# EAGLE schematic radar (EAGLE 6.6.0)
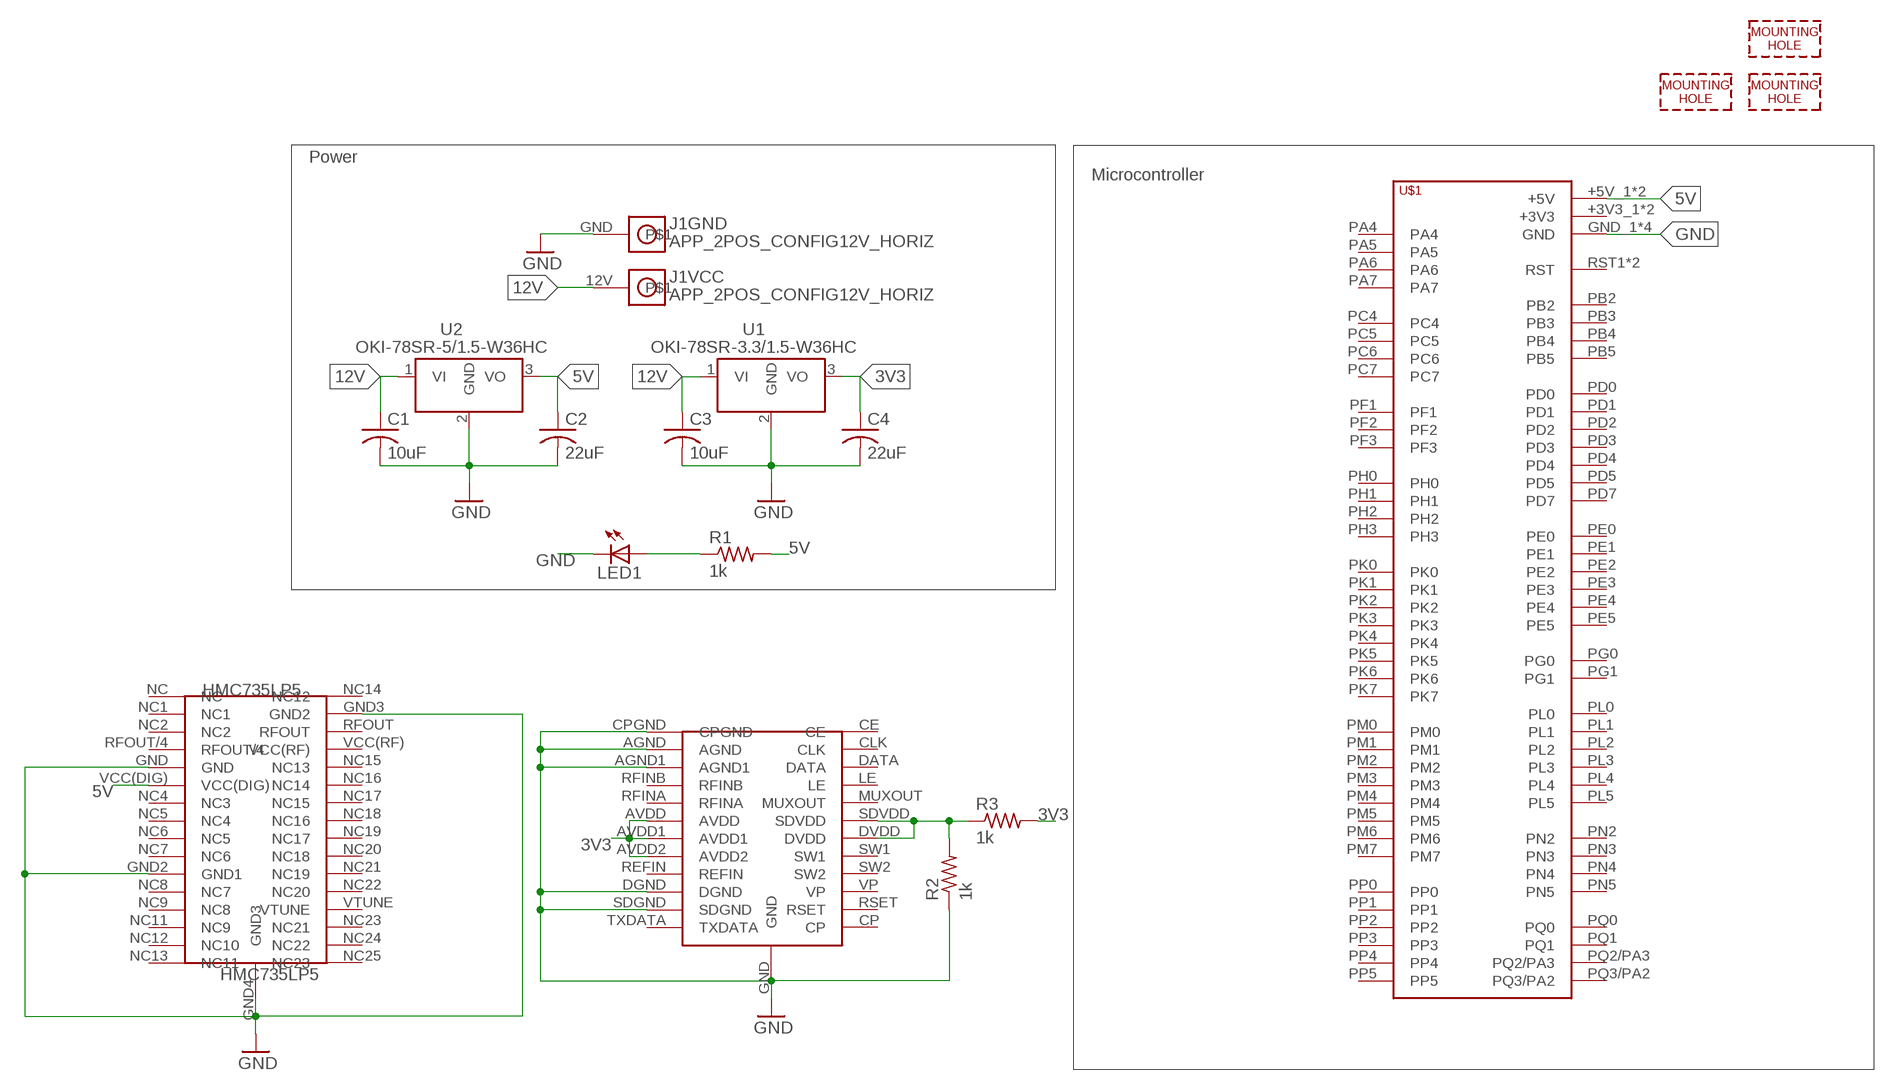
[diagram p0: schematic, sheet 1]

## Parts
C1  10uF  C-USC0603  [C0603]
C2  22uF  C-USC0603  [C0603]
C3  10uF  C-USC0603  [C0603]
C4  22uF  C-USC0603  [C0603]
H1  MOUNTING_HOLE#6  [#6_SCREW]
H2  MOUNTING_HOLE#6  [#6_SCREW]
H3  MOUNTING_HOLE#6  [#6_SCREW]
J1  APP_2POS_CONFIG12V_HORIZ  [APP45_12V_HORIZ_CONFIG]
LED1  LEDCHIP-LED0805  [CHIP-LED0805]
R1  1k  R-US_M0805  [M0805]
R2  1k  R-US_M0805  [M0805]
R3  1k  R-US_M0805  [M0805]
U1  OKI-78SR-3.3/1.5-W36HC  [OKI-78SR_HORIZ]
U2  OKI-78SR-5/1.5-W36HC  [OKI-78SR_HORIZ]
U$1  TIVA-1294  [TIVA-C-CONNECTED]
U$2  HMC735LP5  [HMC735LP5]
U$3  ADF4169  [ADF4169]

## Nets
3V3: C4.1 R3.2 U1.3(VO) U$3.AVDD U$3.AVDD1 U$3.AVDD2
5V: C2.1 R1.2 U2.3(VO) U$1.+5V_1(+5V) U$1.+5V_2(+5V) U$2.VCC(DIG)
12V: C1.1 C3.1 J1.12V U1.1(VI) U2.1(VI)
GND: C1.2 C2.2 C3.2 C4.2 J1.GND LED1.C R2.1 U1.2(GND) U2.2(GND) U$1.GND_1(GND) U$1.GND_2(GND) U$1.GND_3(GND) U$1.GND_4(GND) U$2.GND U$2.GND2(GND1) U$2.GND3(GND2) U$2.GND4(GND3) U$3.AGND U$3.AGND1 U$3.CPGND U$3.DGND U$3.GND U$3.SDGND
N$1: LED1.A R1.1
N$2: R2.2 R3.1 U$3.DVDD U$3.SDVDD
Unconnected: U$1.+3V3_1(+3V3) U$1.+3V3_2(+3V3) U$1.PA4 U$1.PA5 U$1.PA6 U$1.PA7 U$1.PB2 U$1.PB3 U$1.PB4 U$1.PB5 U$1.PC4 U$1.PC5 U$1.PC6 U$1.PC7 U$1.PD0 U$1.PD1 U$1.PD2 U$1.PD3 U$1.PD4 U$1.PD5 U$1.PD7 U$1.PE0 U$1.PE1 U$1.PE2 U$1.PE3 U$1.PE4 U$1.PE5 U$1.PF1 U$1.PF2 U$1.PF3 U$1.PG0 U$1.PG1 U$1.PH0 U$1.PH1 U$1.PH2 U$1.PH3 U$1.PK0 U$1.PK1 U$1.PK2 U$1.PK3 U$1.PK4 U$1.PK5 U$1.PK6 U$1.PK7 U$1.PL0 U$1.PL1 U$1.PL2 U$1.PL3 U$1.PL4 U$1.PL5 U$1.PM0 U$1.PM1 U$1.PM2 U$1.PM3 U$1.PM4 U$1.PM5 U$1.PM6 U$1.PM7 U$1.PN2 U$1.PN3 U$1.PN4 U$1.PN5 U$1.PP0 U$1.PP1 U$1.PP2 U$1.PP3 U$1.PP4 U$1.PP5 U$1.PQ0 U$1.PQ1 U$1.PQ2/PA3 U$1.PQ3/PA2 U$1.RST1(RST) U$1.RST_2(RST) U$2.NC U$2.NC1 U$2.NC2 U$2.NC4(NC3) U$2.NC5(NC4) U$2.NC6(NC5) U$2.NC7(NC6) U$2.NC8(NC7) U$2.NC9(NC8) U$2.NC11(NC9) U$2.NC12(NC10) U$2.NC13(NC11) U$2.NC14(NC12) U$2.NC15(NC13) U$2.NC16(NC14) U$2.NC17(NC15) U$2.NC18(NC16) U$2.NC19(NC17) U$2.NC20(NC18) U$2.NC21(NC19) U$2.NC22(NC20) U$2.NC23(NC21) U$2.NC24(NC22) U$2.NC25(NC23) U$2.RFOUT U$2.RFOUT/4 U$2.VCC(RF) U$2.VTUNE U$3.CE U$3.CLK U$3.CP U$3.DATA U$3.LE U$3.MUXOUT U$3.REFIN U$3.RFINA U$3.RFINB U$3.RSET U$3.SW1 U$3.SW2 U$3.TXDATA U$3.VP

## Notes on the sheet
- Power
- Microcontroller

## Library data of the parts
C1-C4 = rcl:C-US: CAPACITOR, American symbol
H1-H3 = MRDT-Hardware:MOUNTING_HOLE: Mounting hole for M6 bolt. Standard use mounting hole for: Tiva C Connected - M6 Anderson Powerpole Mounting Wing - M8 Most frame-mounted PCB's - M8
J1 = MRDT-Connectors:APP_2POS_CONFIG; COLOR1: YELLOW; COLOR2: BLACK
LED1 = led:LED: LED OSRAM: - CHIPLED LG R971, LG N971, LY N971, LG Q971, LY Q971, LO R971, LY R971 LH N974, LH R974 LS Q976, LO Q976, LY Q976 LO Q996 - Hyper CHIPLED LW Q18S LB Q993, LB Q99A, LB R99A - SideLED LS A670, LO A670, LY A670, LG A670, LP A670 LB A673, LV A673, LT A673, LW A673 LH A674 LY A675 LS A676, LA A676, LO A676, LY A676, LW A676 LS A679, LY A679, LG A679 - Hyper Micro SIDELED® LS Y876, LA Y876, LO Y876, LY Y876 LT Y87S - SmartLED LW L88C, LW L88S LB L89C, LB L89S, LG L890 LS L89K, LO L89K, LY L89K LS L896, LA L896, LO L896, LY L896 - TOPLED LS T670, LO T670, LY T670, LG T670, LP T670 LSG T670, LSP T670, LSY T670, LOP T670, LYG T670 LG T671, LOG T671, LSG T671 LB T673, LV T673, LT T673, LW T673 LH T674 LS T676, LA T676, LO T676, LY T676, LB T676, LH T676, LSB T676, LW T676 LB T67C, LV T67C, LT T67C, LS T67K, LO T67K, LY T67K, LW E67C LS E67B, LA E67B, LO E67B, LY E67B, LB E67C, LV E67C, LT E67C LW T67C LS T679, LY T679, LG T679 LS T770, LO T770, LY T770, LG T770, LP T770 LB T773, LV T773, LT T773, LW T773 LH T774 LS E675, LA E675, LY E675, LS T675 LS T776, LA T776, LO T776, LY T776, LB T776 LHGB T686 LT T68C, LB T68C - Hyper Mini TOPLED® LB M676 - Mini TOPLED Santana® LG M470 LS M47K, LO M47K, LY M47K Source: http://www.osram.convergy.de LUXEON: - LUMILED® LXK2-PW12-R00, LXK2-PW12-S00, LXK2-PW14-U00, LXK2-PW14-V00 LXK2-PM12-R00, LXK2-PM12-S00, LXK2-PM14-U00 LXK2-PE12-Q00, LXK2-PE12-R00, LXK2-PE12-S00, LXK2-PE14-T00, LXK2-PE14-U00 LXK2-PB12-K00, LXK2-PB12-L00, LXK2-PB12-M00, LXK2-PB14-N00, LXK2-PB14-P00, LXK2-PB14-Q00 LXK2-PR12-L00, LXK2-PR12-M00, LXK2-PR14-Q00, LXK2-PR14-R00 LXK2-PD12-Q00, LXK2-PD12-R00, LXK2-PD12-S00 LXK2-PH12-R00, LXK2-PH12-S00 LXK2-PL12-P00, LXK2-PL12-Q00, LXK2-PL12-R00 Source: www.luxeon.com KINGBRIGHT: KA-3528ASYC Source: www.kingbright.com
R1-R3 = rcl:R-US_: RESISTOR, American symbol
U1 = MRDT-ICs:OKI-78SR-*/1.5-W36?C: 4.95W DC/DC Converter Manufacturer: Murata; VOUT: +3v3
U2 = MRDT-ICs:OKI-78SR-*/1.5-W36?C: 4.95W DC/DC Converter Manufacturer: Murata; VOUT: +5v
U$1 = MRDT-Microcontrollers:TIVA-1294: TIVA C CONNECTED LAUNCHPAD
U$2 = HMC735LP5:HMC735LP5
U$3 = ADF4169:ADF4169: PLL